# EAGLE board MotionDetectorCamera (EAGLE 9.6.2), part 1 of 2
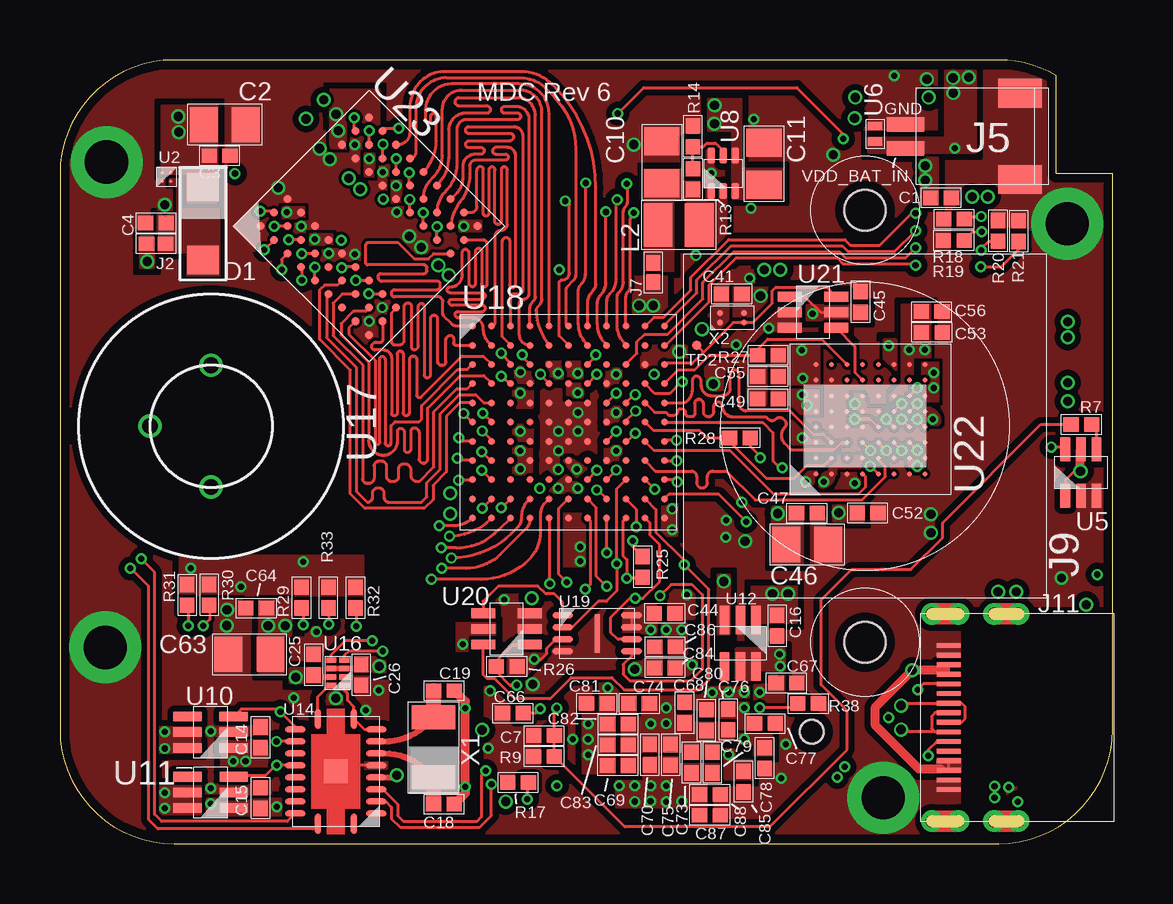
[diagram p9: board, top side]
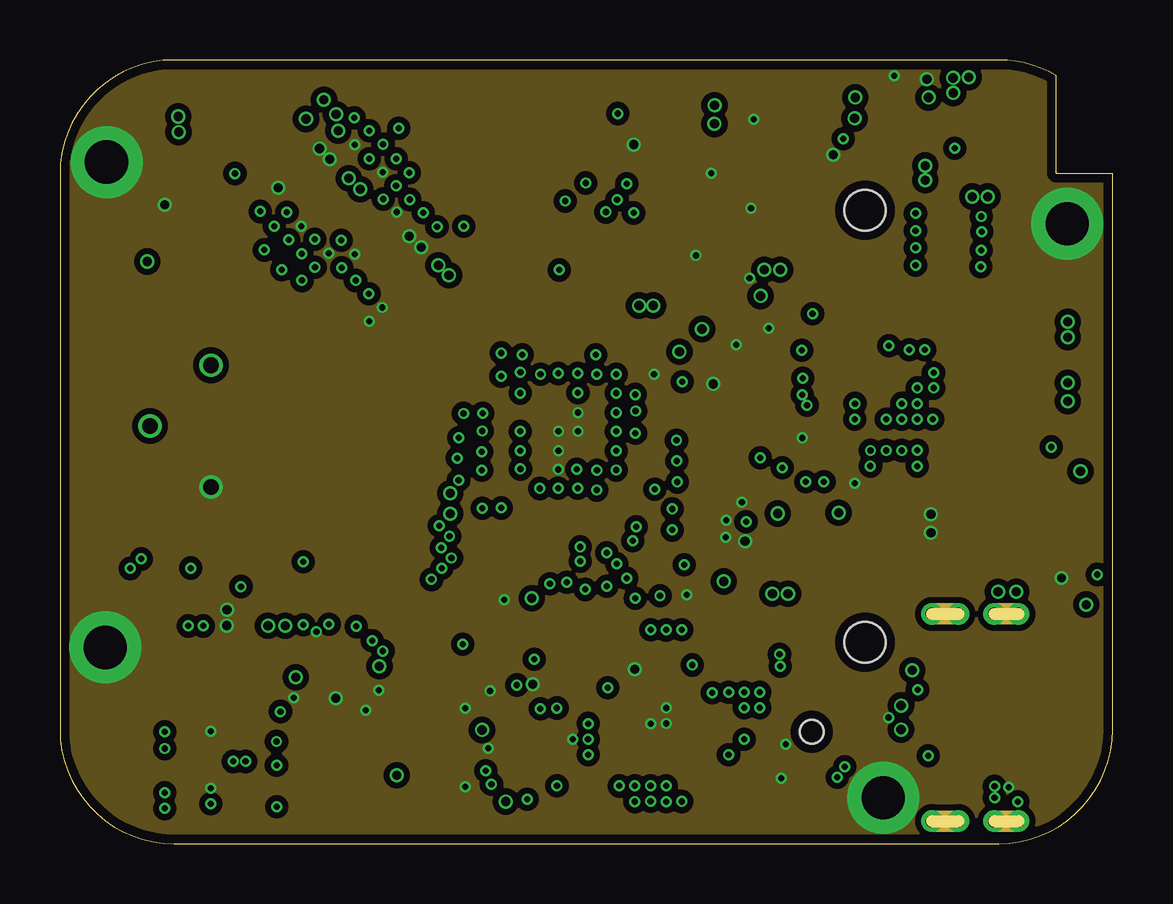
[diagram p10: board, inner layer Ground]
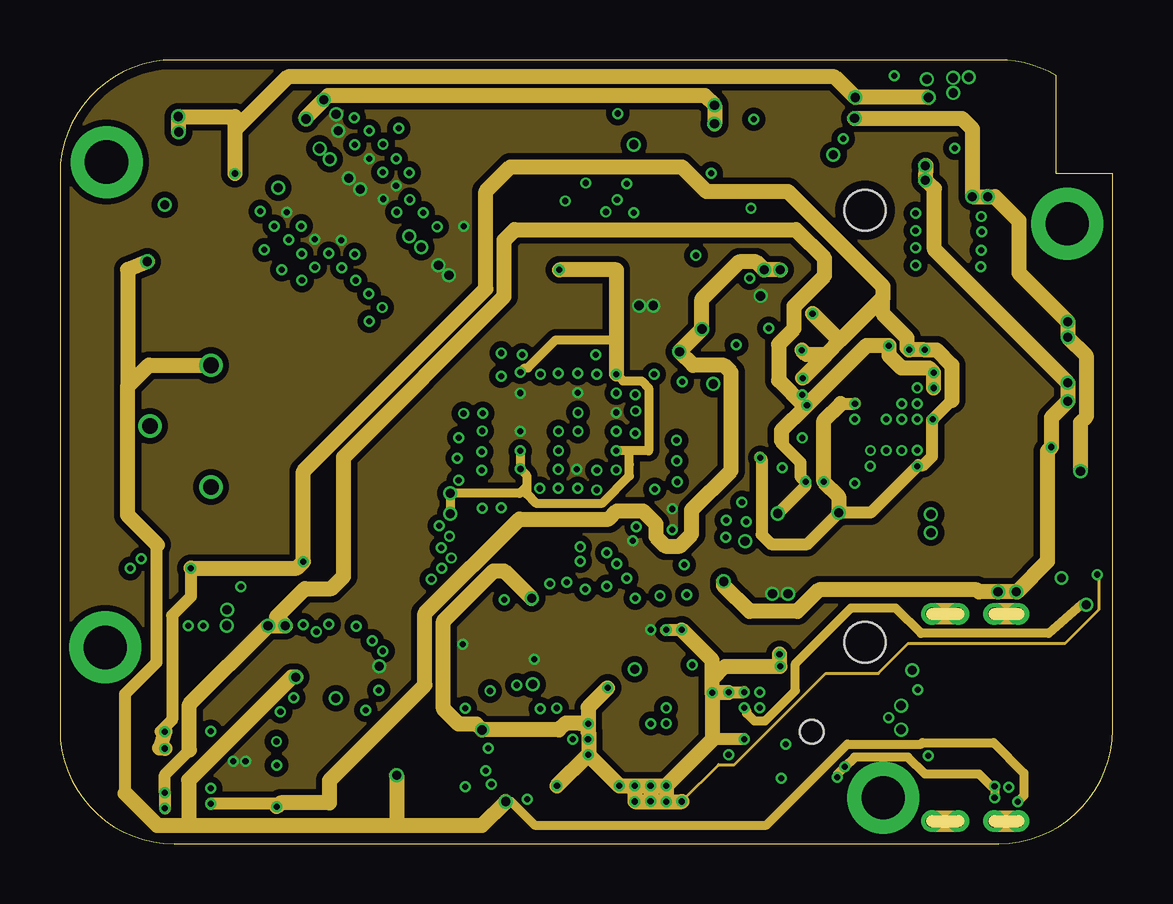
[diagram p11: board, inner layer Power]
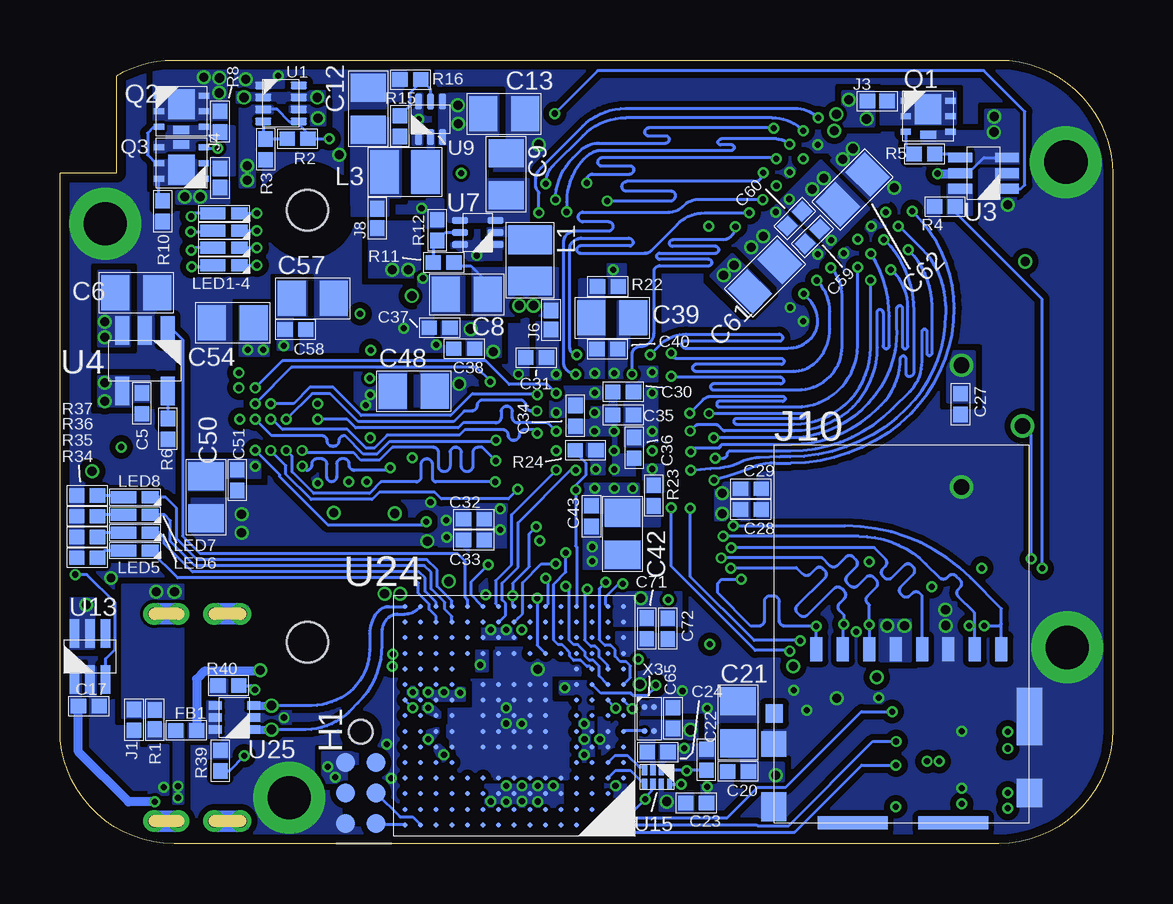
[diagram p12: board, bottom side, seen from below]

Size 43.85 x 32.65 mm. Coordinates in mm from the lower left corner, seen from the top.
Outline: 0,27.9 0,4.75 arc90 4.75,0 39.1,0 arc90 43.85,4.75 43.85,27.94 41.5,27.94 41.5,32 arc30 39.1,32.65 4.75,32.65 arc90 0,27.9
Copper layers (1*2*15*16): Top 0.035559375mm / dielectric 0.17018125mm / Ground 0.01778125mm / dielectric 47mil / Power 0.01778125mm / dielectric 0.17018125mm / Bottom 0.035559375mm
Design rules "oshpark-4layer *": minimum track width 5mil, minimum drill 10mil, track to track 5mil, track to pad 5mil, pad to pad 5mil, via to via 5mil, smd to smd 5mil, copper to edge 15mil, drill to drill 6mil, minimum pad ring 4mil, minimum via ring 4mil, stop-mask expansion 2.5mil, vias tented up to drill 25mil, thermal gap 10mil

## Footprints (pad centres in the part's own frame; a part is rotated, then mirrored left to right if it is on the bottom)
0402 = smd 0.635 x 0.6: 1 -0.432,0; 2 0.432,0
0805 = smd 1.165 x 1.465: 1 -0.875,0; 2 0.875,0
ROHM-SOD-123FL = smd 1.195 x 1.312: 1 -1.525,0; 2 1.525,0
TAGCONNECT-TC2030-NL-EDGE = smd 0.787 x 0.787: 1 -1.27,-0.635; 2 -1.27,0.635; 3 0,-0.635; 4 0,0.635; 5 1.27,-0.635; 6 1.27,0.635 | hole 0.991: -2.54,0
JUMPER-SOLDER = smd 0.65 x 0.6: 1 -0.4,0; 2 0.4,0
JST-SM02B-SRSS-TB = smd 1.2 x 1.8: GND1 -1.8,0; GND2 1.8,0 | smd 0.6 x 1.55: L -0.5,4.775; R 0.5,4.775
M12LENSES-PT-LH008P = hole 1.7: -9,0; 9,0
MOLEX-1051620001 = smd 0.5 x 1: CLK -0.85,0.632; CMD 1.35,0.632; DAT0 -3.05,0.632; DAT1 -4.15,0.632; DAT2 3.55,0.632; DAT3 2.45,0.632; VDD 0.25,0.632; VSS -1.95,0.632 | smd 0.72 x 0.78: DET 5.31,3.312 | smd 1.05 x 1.08: GND1 5.325,4.582 | smd 1.05 x 1.2: GND2 5.325,7.192; GND3 -5.325,6.622 | smd 1.05 x 2.39: GND4 -5.325,3.438 | smd 2.91 x 0.55: NC1 -2.145,7.867; NC2 2.045,7.867
KOREANHRO-TYPE-C-31-M-08A = smd 0.2 x 1: A1 -3,1.125; A4 -2.2,1.125; A5 -1,1.125; A6 -0.2,1.125; A7 0.2,1.125; A8 1,1.125; A9 2.2,1.125; A12 3,1.125; B1 2.6,1.125; B4 1.8,1.125; B5 1.4,1.125; B6 0.6,1.125; B7 -0.6,1.125; B8 -1.4,1.125; B9 -1.8,1.125; B12 -2.6,1.125 | drill 0.5 pad 0.9: GND1 -4.32,1.825; GND2 -4.32,0.725; GND3 4.32,1.825; GND4 4.32,0.725; GND5 4.32,-0.775; GND6 4.32,-1.775; GND7 -4.32,-0.775; GND8 -4.32,-1.775
0806 = smd 1.196 x 1.815: 1 -0.86,0; 2 0.86,0
LED-0603 = smd 0.7 x 0.5: A -0.641,0 | smd 1.05 x 0.5: C 0.475,0
NEXPERIA-SOT1220 = smd 0.43 x 0.25: 1 -0.935,0.65; 2 -0.935,0; 3 -0.935,-0.65; 4 0.935,-0.65; 5 0.935,0; 6 0.935,0.65 | smd 1.1 x 1.25: 7 0,0.285 | smd 0.66 x 0.35: 8 0,-0.775
TEST-POINT = smd 0.4 x 0.4: X 0,0
TI-TPS2116DRLR = smd 0.67 x 0.3: 1 -0.74,0.75; 2 -0.74,0.25; 3 -0.74,-0.25; 4 -0.74,-0.75; 5 0.74,-0.75; 6 0.74,-0.25; 7 0.74,0.25; 8 0.74,0.75
DIODESINC-AP7350 = smd 0.15 x 0.15: 1 -0.175,0.175; 2 -0.175,-0.175; 3 0.175,-0.175; 4 0.175,0.175
NEXPERIA-SOT363 = smd 0.988 x 0.41: 1 -0.97,0.65; 2 -0.97,0; 3 -0.97,-0.65; 4 0.97,-0.65; 5 0.97,0; 6 0.97,0.65
MICROCHIP-MIC550X-SOT23-5 = smd 1.186 x 0.584: 1 -1.264,0.95; 2 -1.264,0; 3 -1.264,-0.95; 4 1.264,-0.95; 5 1.264,0.95
EATON-STN101 = smd 0.35 x 0.6: 1 -0.325,0; 2 0.325,0
TI-TPS62A01DRLR = smd 0.67 x 0.3: 1 -0.74,0.5; 2 -0.74,0; 3 -0.74,-0.5; 4 0.74,-0.5; 5 0.74,0; 6 0.74,0.5
TI-TPS22919DCK = smd 1.186 x 0.397: 1 -0.962,0.65; 2 -0.962,0; 3 -0.962,-0.65; 4 0.962,-0.65; 5 0.962,0; 6 0.962,0.65
TI-MSP430FR2422IRHL = smd 0.26 x 0.86: 1 -0.75,2.185; 10 -0.75,-2.185; 11 0.75,-2.185; 20 0.75,2.185 | smd 0.86 x 0.26: 2 -1.685,1.75; 3 -1.685,1.25; 4 -1.685,0.75; 5 -1.685,0.25; 6 -1.685,-0.25; 7 -1.685,-0.75; 8 -1.685,-1.25; 9 -1.685,-1.75; 12 1.685,-1.75; 13 1.685,-1.25; 14 1.685,-0.75; 15 1.685,-0.25; 16 1.685,0.25; 17 1.685,0.75; 18 1.685,1.25; 19 1.685,1.75 | smd 1 x 1: 21 0,0
NXP-NTB0102GF = smd 0.413 x 0.22: 1 -0.275,0.525; 2 -0.275,0.175; 3 -0.275,-0.175; 4 -0.275,-0.525; 5 0.275,-0.525; 6 0.275,-0.175; 7 0.275,0.175; 8 0.275,0.525
PANASONIC-EKMB110711X = drill 0.65: 1 2.54,0; 2 0,2.54; 3 -2.54,0
LATTICE-ICE40HX4K-BG121 = smd 0.3 x 0.3: A1 -4,4; A2 -3.2,4; A3 -2.4,4; A4 -1.6,4; A5 -0.8,4; A6 0,4; A7 0.8,4; A8 1.6,4; A9 2.4,4; A10 3.2,4; A11 4,4; B1 -4,3.2; B2 -3.2,3.2; B3 -2.4,3.2; B4 -1.6,3.2; B5 -0.8,3.2; B6 0,3.2; B7 0.8,3.2; B8 1.6,3.2; B9 2.4,3.2; B10 3.2,3.2; B11 4,3.2; C1 -4,2.4; C2 -3.2,2.4; C3 -2.4,2.4; C4 -1.6,2.4; C5 -0.8,2.4; C6 0,2.4; C7 0.8,2.4; C8 1.6,2.4; C9 2.4,2.4; C10 3.2,2.4; C11 4,2.4; D1 -4,1.6; D2 -3.2,1.6; D3 -2.4,1.6; D4 -1.6,1.6; D5 -0.8,1.6; D6 0,1.6; D7 0.8,1.6; D8 1.6,1.6; D9 2.4,1.6; D10 3.2,1.6; D11 4,1.6; E1 -4,0.8; E2 -3.2,0.8; E3 -2.4,0.8; E4 -1.6,0.8; E5 -0.8,0.8; E6 0,0.8; E7 0.8,0.8; E8 1.6,0.8; E9 2.4,0.8; E10 3.2,0.8; E11 4,0.8; F1 -4,0; F2 -3.2,0; F3 -2.4,0; F4 -1.6,0; F5 -0.8,0; F6 0,0; F7 0.8,0; F8 1.6,0; F9 2.4,0; F10 3.2,0; F11 4,0; G1 -4,-0.8; G2 -3.2,-0.8; G3 -2.4,-0.8; G4 -1.6,-0.8; G5 -0.8,-0.8; G6 0,-0.8; G7 0.8,-0.8; G8 1.6,-0.8; G9 2.4,-0.8; G10 3.2,-0.8; G11 4,-0.8; H1 -4,-1.6; H2 -3.2,-1.6; H3 -2.4,-1.6; H4 -1.6,-1.6; H5 -0.8,-1.6; H6 0,-1.6; H7 0.8,-1.6; H8 1.6,-1.6; H9 2.4,-1.6; H10 3.2,-1.6; H11 4,-1.6; J1 -4,-2.4; J2 -3.2,-2.4; J3 -2.4,-2.4; J4 -1.6,-2.4; J5 -0.8,-2.4; J6 0,-2.4; J7 0.8,-2.4; J8 1.6,-2.4; J9 2.4,-2.4; J10 3.2,-2.4; J11 4,-2.4; K1 -4,-3.2; K2 -3.2,-3.2; K3 -2.4,-3.2; K4 -1.6,-3.2; K5 -0.8,-3.2; K6 0,-3.2; K7 0.8,-3.2; K8 1.6,-3.2; K9 2.4,-3.2; K10 3.2,-3.2; K11 4,-3.2; L1 -4,-4; L2 -3.2,-4; L3 -2.4,-4; L4 -1.6,-4; L5 -0.8,-4; L6 0,-4; L7 0.8,-4; L8 1.6,-4; L9 2.4,-4; L10 3.2,-4; L11 4,-4
WINBOND-W25Q40EWUXIE = smd 0.86 x 0.27: 1 -1.435,0.75; 2 -1.435,0.25; 3 -1.435,-0.25; 4 -1.435,-0.75; 5 1.435,-0.75; 6 1.435,-0.25; 7 1.435,0.25; 8 1.435,0.75 | smd 0.2 x 1.6: 9 0,0
ON-AR0330CS1C12SPKA0 = smd 0.2 x 0.2: A1 -1.985,2.045; A2 -1.335,2.045; A3 -0.685,2.045; A4 -0.035,2.045; A5 0.615,2.045; A6 1.265,2.045; A7 1.915,2.045; A8 2.565,2.045; B1 -1.985,1.395; B2 -1.335,1.395; B3 -0.685,1.395; B4 -0.035,1.395; B5 0.615,1.395; B6 1.265,1.395; B7 1.915,1.395; B8 2.565,1.395; C1 -1.985,0.745; C2 -1.335,0.745; C3 -0.685,0.745; C4 -0.035,0.745; C5 0.615,0.745; C6 1.265,0.745; C7 1.915,0.745; C8 2.565,0.745; D1 -1.985,0.095; D2 -1.335,0.095; D3 -0.685,0.095; D4 -0.035,0.095; D5 0.615,0.095; D6 1.265,0.095; D7 1.915,0.095; D8 2.565,0.095; E1 -1.985,-0.555; E2 -1.335,-0.555; E3 -0.685,-0.555; E4 -0.035,-0.555; E5 0.615,-0.555; E6 1.265,-0.555; E7 1.915,-0.555; E8 2.565,-0.555; F1 -1.985,-1.205; F2 -1.335,-1.205; F3 -0.685,-1.205; F4 -0.035,-1.205; F5 0.615,-1.205; F6 1.265,-1.205; F7 1.915,-1.205; F8 2.565,-1.205; G1 -1.985,-1.855; G2 -1.335,-1.855; G3 -0.685,-1.855; G4 -0.035,-1.855; G5 0.615,-1.855; G6 1.265,-1.855; G7 1.915,-1.855; G8 2.565,-1.855; H1 -1.985,-2.505; H2 -1.335,-2.505; H3 -0.685,-2.505; H4 -0.035,-2.505; H5 0.615,-2.505; H6 1.265,-2.505; H7 1.915,-2.505; H8 2.565,-2.505
ALLIANCE-AS4C8M16MSA-6BIN = smd 0.33 x 0.33: A1 -3.2,3.2; A2 -2.4,3.2; A3 -1.6,3.2; A7 1.6,3.2; A8 2.4,3.2; A9 3.2,3.2; B1 -3.2,2.4; B2 -2.4,2.4; B3 -1.6,2.4; B7 1.6,2.4; B8 2.4,2.4; B9 3.2,2.4; C1 -3.2,1.6; C2 -2.4,1.6; C3 -1.6,1.6; C7 1.6,1.6; C8 2.4,1.6; C9 3.2,1.6; D1 -3.2,0.8; D2 -2.4,0.8; D3 -1.6,0.8; D7 1.6,0.8; D8 2.4,0.8; D9 3.2,0.8; E1 -3.2,0; E2 -2.4,0; E3 -1.6,0; E7 1.6,0; E8 2.4,0; E9 3.2,0; F1 -3.2,-0.8; F2 -2.4,-0.8; F3 -1.6,-0.8; F7 1.6,-0.8; F8 2.4,-0.8; F9 3.2,-0.8; G1 -3.2,-1.6; G2 -2.4,-1.6; G3 -1.6,-1.6; G7 1.6,-1.6; G8 2.4,-1.6; G9 3.2,-1.6; H1 -3.2,-2.4; H2 -2.4,-2.4; H3 -1.6,-2.4; H7 1.6,-2.4; H8 2.4,-2.4; H9 3.2,-2.4; J1 -3.2,-3.2; J2 -2.4,-3.2; J3 -1.6,-3.2; J7 1.6,-3.2; J8 2.4,-3.2; J9 3.2,-3.2
STM-STM32F730I8 = smd 0.2 x 0.2: A1 -4.55,4.55; A2 -3.9,4.55; A3 -3.25,4.55; A4 -2.6,4.55; A5 -1.95,4.55; A6 -1.3,4.55; A7 -0.65,4.55; A8 0,4.55; A9 0.65,4.55; A10 1.3,4.55; A11 1.95,4.55; A12 2.6,4.55; A13 3.25,4.55; A14 3.9,4.55; A15 4.55,4.55; B1 -4.55,3.9; B2 -3.9,3.9; B3 -3.25,3.9; B4 -2.6,3.9; B5 -1.95,3.9; B6 -1.3,3.9; B7 -0.65,3.9; B8 0,3.9; B9 0.65,3.9; B10 1.3,3.9; B11 1.95,3.9; B12 2.6,3.9; B13 3.25,3.9; B14 3.9,3.9; B15 4.55,3.9; C1 -4.55,3.25; C2 -3.9,3.25; C3 -3.25,3.25; C4 -2.6,3.25; C5 -1.95,3.25; C6 -1.3,3.25; C7 -0.65,3.25; C8 0,3.25; C9 0.65,3.25; C10 1.3,3.25; C11 1.95,3.25; C12 2.6,3.25; C13 3.25,3.25; C14 3.9,3.25; C15 4.55,3.25; D1 -4.55,2.6; D2 -3.9,2.6; D3 -3.25,2.6; D4 -2.6,2.6; D5 -1.95,2.6; D6 -1.3,2.6; D7 -0.65,2.6; D8 0,2.6; D9 0.65,2.6; D10 1.3,2.6; D11 1.95,2.6; D12 2.6,2.6; D13 3.25,2.6; D14 3.9,2.6; D15 4.55,2.6; E1 -4.55,1.95; E2 -3.9,1.95; E3 -3.25,1.95; E4 -2.6,1.95; E12 2.6,1.95; E13 3.25,1.95; E14 3.9,1.95; E15 4.55,1.95; F1 -4.55,1.3; F2 -3.9,1.3; F3 -3.25,1.3; F4 -2.6,1.3; F6 -1.3,1.3; F7 -0.65,1.3; F8 0,1.3; F9 0.65,1.3; F10 1.3,1.3; F12 2.6,1.3; F13 3.25,1.3; F14 3.9,1.3; F15 4.55,1.3; G1 -4.55,0.65; G2 -3.9,0.65; G3 -3.25,0.65; G4 -2.6,0.65; G6 -1.3,0.65; G7 -0.65,0.65; G8 0,0.65; G9 0.65,0.65; G10 1.3,0.65; G12 2.6,0.65; G13 3.25,0.65; G14 3.9,0.65; G15 4.55,0.65; H1 -4.55,0; H2 -3.9,0; H3 -3.25,0; H4 -2.6,0; H6 -1.3,0; H7 -0.65,0; H8 0,0; H9 0.65,0; H10 1.3,0; H12 2.6,0; H13 3.25,0; H14 3.9,0; H15 4.55,0; J1 -4.55,-0.65; J2 -3.9,-0.65; J3 -3.25,-0.65; J4 -2.6,-0.65; J6 -1.3,-0.65; J7 -0.65,-0.65; J8 0,-0.65; J9 0.65,-0.65; J10 1.3,-0.65; J12 2.6,-0.65; J13 3.25,-0.65; J14 3.9,-0.65; J15 4.55,-0.65; K1 -4.55,-1.3; K2 -3.9,-1.3; K3 -3.25,-1.3; K4 -2.6,-1.3; K6 -1.3,-1.3; K7 -0.65,-1.3; K8 0,-1.3; K9 0.65,-1.3; K10 1.3,-1.3; K12 2.6,-1.3; K13 3.25,-1.3; K14 3.9,-1.3; K15 4.55,-1.3; L1 -4.55,-1.95; L2 -3.9,-1.95; L3 -3.25,-1.95; L4 -2.6,-1.95; L12 2.6,-1.95; L13 3.25,-1.95; L14 3.9,-1.95; L15 4.55,-1.95; M1 -4.55,-2.6; M2 -3.9,-2.6; M3 -3.25,-2.6; M4 -2.6,-2.6; M5 -1.95,-2.6; M6 -1.3,-2.6; M7 -0.65,-2.6; M8 0,-2.6; M9 0.65,-2.6; M10 1.3,-2.6; M11 1.95,-2.6; M12 2.6,-2.6; M13 3.25,-2.6; M14 3.9,-2.6; M15 4.55,-2.6; N1 -4.55,-3.25; N2 -3.9,-3.25; N3 -3.25,-3.25; N4 -2.6,-3.25; N5 -1.95,-3.25; N6 -1.3,-3.25; N7 -0.65,-3.25; N8 0,-3.25; N9 0.65,-3.25; N10 1.3,-3.25; N11 1.95,-3.25; N12 2.6,-3.25; N13 3.25,-3.25; N14 3.9,-3.25; N15 4.55,-3.25; P1 -4.55,-3.9; P2 -3.9,-3.9; P3 -3.25,-3.9; P4 -2.6,-3.9; P5 -1.95,-3.9; P6 -1.3,-3.9; P7 -0.65,-3.9; P8 0,-3.9; P9 0.65,-3.9; P10 1.3,-3.9; P11 1.95,-3.9; P12 2.6,-3.9; P13 3.25,-3.9; P14 3.9,-3.9; P15 4.55,-3.9; R1 -4.55,-4.55; R2 -3.9,-4.55; R3 -3.25,-4.55; R4 -2.6,-4.55; R5 -1.95,-4.55; R6 -1.3,-4.55; R7 -0.65,-4.55; R8 0,-4.55; R9 0.65,-4.55; R10 1.3,-4.55; R11 1.95,-4.55; R12 2.6,-4.55; R13 3.25,-4.55; R14 3.9,-4.55; R15 4.55,-4.55
DIODESINC-DT1446-04V-7 = smd 0.546 x 0.337: 1 -0.796,0.5; 2 -0.796,0; 3 -0.796,-0.5; 4 0.796,-0.5; 5 0.796,0; 6 0.796,0.5
EPSON-FC-135 = smd 1 x 1.8: 1 -1.25,0; 2 1.25,0
SITIME-SIT8021 = smd 0.25 x 0.25: 1 -0.205,0.5; 2 -0.205,-0.5; 3 0.205,-0.5; 4 0.205,0.5

## Placement (x,y rotation side)
C1  2.2u  [0402]  36.71,26.9 0 top
C2  10u  [0805]  6.86,29.96 0 top
C3  100n  [0402]  6.65,28.66 0 top
C4  100n  [0402]  4,25.86 180 top
C5  2.2u  [0402]  40.45,18.34 270 bottom
C6  10u  [0805]  40.68,22.96 0 bottom
C7  100n  [0402]  20.17,4.5 180 top
C8  22u  [0805]  26.91,22.88 180 bottom
C9  10u  [0805]  25.27,27.89 90 bottom
C10  22u  [0805]  25.08,28.4 90 top
C11  10u  [0805]  29.33,28.33 90 top
C12  22u  [0805]  31.01,30.62 90 bottom
C13  10u  [0805]  25.35,30.41 0 bottom
C14  2.2u  [0402]  8.36,4.43 90 top
C15  2.2u  [0402]  8.36,1.9 90 top
C16  2.2u  [0402]  29.88,9.08 270 top
C17  2.2u  [0402]  42.65,5.73 0 bottom
C18  22p  [0402]  16,1.65 0 top
C19  22p  [0402]  16,6.37 0 top
C20  100n  [0402]  15.6,3.01 180 bottom
C21  10u  [0805]  15.61,5.05 90 bottom
C22  22p  [0402]  16.92,3.49 90 bottom
C23  100n  [0402]  17.35,1.69 0 bottom
C24  100n  [0402]  18.95,3.81 0 bottom
C25  100n  [0402]  10.57,7.45 90 top
C26  100n  [0402]  12.55,7.03 270 top
C27  100n  [0402]  6.33,18.31 270 bottom
C28  100n  [0402]  15.07,13.92 0 bottom
C29  10n  [0402]  15.07,14.78 0 bottom
C30  100n  [0402]  20.39,18.82 180 bottom
C31  10n  [0402]  24.01,20.25 180 bottom
C32  100n  [0402]  26.61,13.52 180 bottom
C33  10n  [0402]  26.61,12.65 180 bottom
C34  10n  [0402]  22.38,17.82 270 bottom
C35  100n  [0402]  20.39,17.86 180 bottom
C36  10n  [0402]  19.93,16.49 270 bottom
C37  100n  [0402]  28.04,21.49 180 bottom
C38  10n  [0402]  27.01,20.62 180 bottom
C39  10u  [0805]  20.85,21.91 0 bottom
C40  100n  [0402]  21.04,20.6 0 bottom
C41  10n  [0402]  27.98,22.9 180 top
C42  10u  [0805]  20.41,12.9 270 bottom
C43  100n  [0402]  21.71,13.64 270 bottom
C44  100n  [0402]  25.19,9.6 0 top
C45  100n  [0402]  33.36,22.58 90 top
C46  10u  [0805]  31.13,12.46 0 top
C47  100n  [0402]  31.12,13.77 0 top
C48  10u  [0805]  29.11,18.85 0 bottom
C49  100n  [0402]  29.5,18.53 180 top
C50  10u  [0805]  37.77,14.44 270 bottom
C51  100n  [0402]  36.47,15.15 270 bottom
C52  100n  [0402]  33.65,13.78 0 top
C53  100n  [0402]  36.32,21.3 0 top
C54  10u  [0805]  36.66,21.71 180 bottom
C55  100n  [0402]  29.5,19.46 180 top
C56  100n  [0402]  36.31,22.17 0 top
C57  10u  [0805]  33.33,22.72 0 bottom
C58  100n  [0402]  34.04,21.42 0 bottom
C59  100n  [0402]  12.5,25.3 225 bottom
C60  100n  [0402]  13.24,26.04 225 bottom
C61  10u  [0805]  14.48,23.63 45 bottom
C62  10u  [0805]  10.83,27.26 45 bottom
C63  10u  [0805]  7.89,7.88 180 top
C64  100n  [0402]  8.18,9.81 180 top
C65  10n  [0402]  18.31,5.22 90 bottom
C66  100n  [0402]  18.87,5.43 180 top
C67  2.2u  [0402]  30.26,6.69 0 top
C68  100n  [0402]  26.02,5.46 270 top
C69  100n  [0402]  23.24,3.26 0 top
C70  100n  [0402]  24.57,3.71 90 top
C71  100n  [0402]  19.41,8.96 270 bottom
C72  2.2u  [0402]  18.53,8.96 270 bottom
C73  100n  [0402]  26.31,3.38 90 top
C74  100n  [0402]  24.13,5.84 0 top
C75  100n  [0402]  25.45,3.7 90 top
C76  100n  [0402]  27.84,5.17 270 top
C77  2.2u  [0402]  29.37,5 0 top
C78  100n  [0402]  29.35,3.56 270 top
C79  100n  [0402]  27.18,3.38 90 top
C80  100n  [0402]  26.93,5.14 270 top
C81  100n  [0402]  22.37,5.84 180 top
C82  100n  [0402]  23.25,4.98 0 top
C83  100n  [0402]  23.25,4.12 0 top
C84  2.2u  [0402]  25.21,7.32 180 top
C85  2.2u  [0402]  28.48,2.59 270 top
C86  2.2u  [0402]  25.21,8.2 180 top
C87  2.2u  [0402]  27.08,1.18 0 top
C88  2.2u  [0402]  27.08,2.05 0 top
D1  ROHM-RB168MM-40  [ROHM-SOD-123FL]  5.96,25.84 90 top
FB1  FERRITE-BEAD0402  [0402]  38.59,4.72 180 bottom
H1  TAGCONNECT-TC2030-NLEDGE  [TAGCONNECT-TC2030-NL-EDGE]  31.33,2.12 270 bottom
J1  JUMPER-SOLDER  [JUMPER-SOLDER]  39.91,5.16 90 bottom
J2  JUMPER-SOLDER  [JUMPER-SOLDER]  4,24.99 180 top
J3  JUMPER-SOLDER  [JUMPER-SOLDER]  9.8,30.94 180 bottom
J4  JUMPER-SOLDER  [JUMPER-SOLDER]  37.19,27.73 90 bottom
J5  JST-SM02B-SRSS-TB  [JST-SM02B-SRSS-TB]  40,29.47 90 top
J6  JUMPER-SOLDER  [JUMPER-SOLDER]  23.4,21.82 270 bottom
J7  JUMPER-SOLDER  [JUMPER-SOLDER]  24.72,23.8 270 top
J8  JUMPER-SOLDER  [JUMPER-SOLDER]  30.64,26.05 270 bottom
J9  S-MOUNT-LENS-HOLDERM12LENSES-PT-LH008P  [M12LENSES-PT-LH008P]  33.54,17.39 90 top
J10  MICROSD-SOCKET  [MOLEX-1051620001]  8.78,8.73 180 bottom
J11  USB-C-RECEPTACLE-KOREANHRO  [KOREANHRO-TYPE-C-31-M-08A]  38.15,5.25 90 top
L1  1u  [0806]  24.26,24.3 270 bottom
L2  1u  [0806]  25.77,25.77 180 top
L3  1u  [0806]  29.48,27.99 180 bottom
LED1  LED  [LED-0603]  37.01,26.26 180 bottom
LED2  LED  [LED-0603]  37.01,25.54 180 bottom
LED3  LED  [LED-0603]  37.01,24.82 180 bottom
LED4  LED  [LED-0603]  37.01,24.1 180 bottom
LED5  LED  [LED-0603]  40.73,12.21 180 bottom
LED6  LED  [LED-0603]  40.73,12.95 180 bottom
LED7  LED  [LED-0603]  40.73,13.69 180 bottom
LED8  LED  [LED-0603]  40.73,14.43 180 bottom
Q1  PMOS-NEXPERIA-SOT1220  [NEXPERIA-SOT1220]  7.68,30.31 0 bottom
Q2  PMOS-NEXPERIA-SOT1220  [NEXPERIA-SOT1220]  38.8,30.51 0 bottom
Q3  PMOS-NEXPERIA-SOT1220  [NEXPERIA-SOT1220]  38.8,28.35 180 bottom
R1  100k  [0402]  40.77,5.16 270 bottom
R2  300k  [0402]  33.96,29.37 180 bottom
R3  100k  [0402]  35.29,28.93 270 bottom
R4  100k  [0402]  6.98,26.54 180 bottom
R5  10k  [0402]  7.84,28.73 0 bottom
R6  2.7k  [0402]  39.36,17.28 90 bottom
R7  300k  [0402]  42.56,17.46 180 top
R8  100k  [0402]  37.19,30.09 270 bottom
R9  100k  [0402]  20.16,3.63 180 top
R10  100k  [0402]  39.58,26.35 270 bottom
R11  100k  [0402]  27.87,24.21 180 bottom
R12  100k  [0402]  28.14,25.56 90 bottom
R13  200k  [0402]  26.37,27.69 90 top
R14  100k  [0402]  26.37,29.47 90 top
R15  365k  [0402]  29.69,29.9 90 bottom
R16  100k  [0402]  29.25,31.83 180 bottom
R17  10k  [0402]  19.09,2.55 0 top
R18  1.8k  [0402]  37.25,26.02 180 top
R19  1.8k  [0402]  37.24,25.13 180 top
R20  1.8k  [0402]  39.08,25.53 90 top
R21  1.8k  [0402]  39.94,25.52 90 top
R22  100  [0402]  21.03,23.21 0 bottom
R23  100  [0402]  19.12,14.5 90 bottom
R24  10k  [0402]  21.96,16.39 180 bottom
R25  10k  [0402]  24.28,11.53 270 top
R26  10k  [0402]  18.61,7.38 0 top
R27  10k  [0402]  29.5,20.35 0 top
R28  10k  [0402]  28.33,16.9 180 top
R29  47k  [0402]  10.06,10.24 90 top
R30  47k  [0402]  6.21,10.37 90 top
R31  47k  [0402]  5.3,10.36 90 top
R32  47k  [0402]  12.32,10.25 90 top
R33  47k  [0402]  11.18,10.25 90 top
R34  1.8k  [0402]  42.72,11.91 180 bottom
R35  1.8k  [0402]  42.72,12.78 180 bottom
R36  1.8k  [0402]  42.72,13.64 180 bottom
R37  1.8k  [0402]  42.72,14.5 180 bottom
R38  3k  [0402]  31.17,5.83 180 top
R39  5.1k  [0402]  37.17,3.45 90 bottom
R40  5.1k  [0402]  36.84,6.58 180 bottom
TP2  TEST-POINT  [TEST-POINT]  26.52,20.77 0 top
U1  TI-TPS2116  [TI-TPS2116DRLR]  34.65,30.84 0 bottom
U2  DIODESINC-AP7350  [DIODESINC-AP7350]  4.44,27.78 0 top
U3  NEXPERIA-74LVC1G98-NOR  [NEXPERIA-SOT363]  5.37,27.94 180 bottom
U4  MICROCHIP-MCP7383X  [MICROCHIP-MIC550X-SOT23-5]  40.32,20.12 270 bottom
U5  NEXPERIA-74LVC1G98-BUFFER  [NEXPERIA-SOT363]  42.54,15.46 90 top
U6  EATON-STN101  [EATON-STN101]  33.96,29.58 90 top
U7  TI-TPS62A01  [TI-TPS62A01DRLR]  26.45,25.46 180 bottom
U8  TI-TPS62A01  [TI-TPS62A01DRLR]  27.63,27.92 90 top
U9  TI-TPS62A01  [TI-TPS62A01DRLR]  28.42,30.18 90 bottom
U10  TI-TPS22919DCK  [TI-TPS22919DCK]  6.27,4.64 180 top
U11  TI-TPS22919DCK  [TI-TPS22919DCK]  6.28,2.14 180 top
U12  TI-TPS22919DCK  [TI-TPS22919DCK]  28.35,8.35 270 top
U13  TI-TPS22919DCK  [TI-TPS22919DCK]  42.6,7.8 90 bottom
U14  TI-MSP430FR2422IRHL  [TI-MSP430FR2422IRHL]  11.49,3.01 180 top
U15  NXP-NTB0102  [NXP-NTB0102GF]  18.98,2.77 270 bottom
U16  NXP-NTB0102  [NXP-NTB0102GF]  11.57,7.12 180 top
U17  PANASONIC-EKMB110711X  [PANASONIC-EKMB110711X]  6.29,17.39 90 top
U18  LATTICE-ICE40HX4K-BG121  [LATTICE-ICE40HX4K-BG121]  21.18,17.56 0 top
U19  WINBOND-W25Q40EW  [WINBOND-W25Q40EWUXIE]  22.38,8.76 0 top
U20  NEXPERIA-74LVC1G98-OR-INV-INPUT  [NEXPERIA-SOT363]  18.61,8.94 180 top
U21  NEXPERIA-74LVC1G98-BUFFER  [NEXPERIA-SOT363]  31.38,22.14 0 top
U22  ON-AR0330CS1C12SPKA0  [ON-AR0330CS1C12SPKA0]  33.54,17.39 90 top
U23  ALLIANCE-AS4C8M16MSA-6BIN  [ALLIANCE-AS4C8M16MSA-6BIN]  12.88,25.72 45 top
U24  STM-STM32F730  [STM-STM32F730I8]  24.93,5.33 180 bottom
U25  DIODESINC-DT1446-04V-7  [DIODESINC-DT1446-04V-7]  36.58,5.25 180 bottom
X1  EPSON-FC-135  [EPSON-FC-135]  15.57,4.01 90 top
X2  SITIME-SIT8021  [SITIME-SIT8021]  28.01,21.91 90 top
X3  SITIME-SIT8021  [SITIME-SIT8021]  19.3,5.2 0 bottom

## Tracks (layer width: path | path; a pad name or v marks a point on that pad's centre or on a via)
BAT_CHRG_LVL  (via drill 0.25)
  Top 0.127: v20.7,5.65 20.6,5.54 C7.1 R9.1 23.54,0.69 29.57,0.69 32.79,3.92 32.79,5.53 31.72,6.61 31.72,10.16 32.99,11.43 35.45,11.43 36.77,12.75 36.77,13.37 40.87,17.46 R7.2
  Bottom 0.127: U24.J2 v20.7,5.65
BAT_CHRG_STAT
  Bottom 0.127: U4.1 39.14,21.39 38.75,21 38.75,12.81 38.03,12.09 27.3,12.09 26.99,11.78 26.99,10.28 26.88,10.17 U24.R11
GND  (via drill 0.25, 0.35, 0.38, 1.8 pad 3)
  Top 0.127: U14.6 11.49,3.26 U14.21
  Top 0.381: C18.2 16.89,2.1 v16.89,2.37 v16.89,5.65 16.89,5.91 C19.2
  other vias: 21.58,17.96 21.58,17.17 20.77,17.17 20.77,16.36 25.26,5 25.25,5.65 24.61,5 21.36,4.35 10.81,28.96 11.24,28.51 14.56,25.3 15.06,24.84 9.09,27.33 10.06,25.73 11.2,24.59 12.89,21.76 12.29,29.11 13.45,27.97 12.28,24.56 14.04,26.32 6.96,9.74 6.95,9.09 4.36,26.62 19.69,6.63 23.95,7.26 27.76,13.47 27.75,12.76 17.84,3.97 20.77,15.59 13.43,22.34 11.5,6.06 28.54,12.6 26.12,10.37 27.13,27.93 28.9,30.19 28.42,14.22 6.28,4.68 6.28,2.3 27.22,19.15 18.51,10.16 17.92,6.36 33.11,15.01 36.12,31.84 34.76,32 28.18,20.78 29.53,21.47 30.24,4.14 30.05,2.72 13.29,6.39 12.74,5.55 9.74,6.07 24.75,19.56 28.73,23.56 34.52,5.25 26.5,24.51 23.91,29.13 32.23,28.7 28.79,26.47 36.29,13.72 36.29,12.95 30.93,16.9 1.89,8.17 1.94,28.4 41.73,11.07 41.97,25.83 34.31,1.91 39.52,2.35 10.69,8.83
  pour Ground (isolate 0.254, rank 6, no thermals): -2.64,35.56 -2.64,-3.1 47.38,-3.1 47.38,35.56
  pour Top (rank 2, no thermals): 20.14,18.91 20.14,15.87 20.6,15.41 20.75,15.41 21.85,16.51 22.07,16.51 22.19,16.64 22.19,18.35 20.87,18.35 20.87,18.91
  pour Top (isolate 0.254, rank 6, no thermals): -1.91,34.65 -1.91,-2.1 46.51,-2.1 46.51,34.65
  pour Bottom (isolate 0.254, rank 6, no thermals): -3.58,36.53 -3.58,-3.91 48.32,-3.91 48.32,36.53
  pour Bottom (no thermals): 26.77,13.79 26.77,12.38 28.06,12.38 28.06,13.79
  pour Bottom (no thermals): 8.73,27.34 9.67,26.39 11.74,28.46 10.8,29.4
  pour Bottom (no thermals): 11.97,24.59 13.65,22.91 15.68,24.94 14,26.62
  pour Top (no thermals): 7.69,25.4 8.09,25 8.67,25.58 8.27,25.98
  pour Top (rank 2, no thermals): 7.05,25.71 12.9,19.86 18.75,25.7 12.89,31.56
  pour Top (rank 3, no thermals): 30.44,14.53 37.11,14.53 37.11,20.85 30.44,20.85
  pour Top (no thermals): 11.14,3.15 13.64,3.15 13.64,3.37 11.83,3.37 11.83,5.57 11.14,5.57
  pour Top: 33.82,19.21 arc90 33.57,18.95 arc90 33.97,18.55 34.17,18.55 34.17,18.86 arc90
  pour Top (rank 3, no thermals): 4.1,26.37 4.72,26.37 4.72,27.73 4.1,27.73
  pour Top (no thermals): 6.43,10.15 6.43,7.07 7.56,7.07 7.56,10.15
  pour Bottom (rank 2, no thermals): 16.58,4.2 16.58,3.48 18.63,3.48 18.63,2.9 18.94,2.9 18.94,4.2
  pour Bottom (no thermals): 18.05,5.97 18.05,5.37 19.65,5.37 19.65,5.97
  pour Top (rank 2, no thermals): 20.41,8.18 20.41,8.03 19.4,7.01 19.4,6.25 20.16,6.25 20.16,6.76 20.92,7.52 21.39,7.52 21.39,8.18
  pour Bottom (rank 2, no thermals): 24.73,8.03 24.73,6.51 25.75,6.51 25.75,8.03
  pour Bottom (rank 2, no thermals): 22.7,4.22 22.7,2.68 25.75,2.68 25.75,4.22
  pour Top (no thermals): 24.48,8.41 24.48,7.54 23.72,7.54 23.72,7.01 25.07,7.01 25.07,8.41
  pour Bottom (no thermals): 19.14,8.79 20.67,8.79 20.67,7.78 19.14,7.78
  pour Bottom (no thermals): 22.19,7.52 22.19,7.01 24.23,7.01 24.23,7.52
  pour Top (no thermals): 11.15,4.5 11.15,6.28 11.9,6.28 11.9,4.5
  pour Bottom (rank 2, no thermals): 20.98,5.24 20.98,3.97 21.54,3.97 21.54,5.24
  pour Top (no thermals): 25.37,10.63 25.37,9.4 26.42,9.4 26.42,10.63
  pour Top (rank 2, no thermals): 6.12,4.84 6.12,4.49 8.67,4.49 8.67,5.17 8.11,5.17 8.11,4.84
  pour Top (rank 2, no thermals): 6.12,2.45 7.99,2.45 7.99,2.58 8.75,2.58 8.75,2.03 6.12,2.03
  pour Bottom (no thermals): 26.97,19.66 26.97,18.15 28.8,18.15 28.8,19.66
  pour Top (no thermals): 11.71,6.99 12.85,6.99 12.85,6.35 12.28,6.35 12.28,6.86 11.71,6.86
  pour Top (rank 2, no thermals): 23.4,5.22 23.4,2.96 24.1,2.96 24.1,3.85 26,3.85 26,3.54 27.43,3.54 27.43,4.39 28.12,4.39 28.12,5.02 26.38,5.02 26.38,5.33 25.62,5.33 25.62,6.1 24.25,6.1 24.25,5.22
  pour Bottom (rank 2, no thermals): 28.77,31.24 28.77,29.13 29.14,29.13 29.14,31.24
  pour Top (rank 2, no thermals): 28.92,23.88 27.15,23.88 27.15,21.51 27.91,21.51 27.91,23.33 28.92,23.33
  pour Bottom (rank 2, no thermals): 36.89,6.86 36.89,6.1 36.04,6.1 36.04,4.32 36.82,4.32 36.82,3.56 37.56,3.56 37.56,4.57 37.21,4.57 37.21,6.1 37.56,6.1 37.56,6.86
  pour Bottom (no thermals): 34.26,5.72 34.26,4.83 36.04,4.83 36.04,5.72
  pour Bottom (no thermals): 27.15,23.62 28.92,23.62 28.92,22.1 27.15,22.1
  pour Bottom (no thermals): 25.42,25.08 27.4,25.08 27.4,24.89 26.84,24.34 26.23,24.34 25.73,24.83 25.42,24.83
  pour Top (no thermals): 26.95,28.96 26.95,26.94 27.22,26.94 27.22,28.96
  pour Bottom (no thermals): 27.91,26.84 27.91,25.65 28.55,25.65 28.55,26.84
  pour Bottom (no thermals): 3.93,28.11 5.56,28.11 5.56,26.35 4.03,26.35 4.03,26.92 5.05,26.92 5.05,27.69 3.93,27.69
  pour Bottom (no thermals): 26.13,5.59 27.6,5.59 27.6,3.96 26.13,3.96
  pour Top (no thermals): 29.4,20.1 29.4,18.3 28.7,18.3 28.7,19.6 27.6,19.6 27.6,18.9 26.9,18.9 26.9,20.1
  pour Bottom (no thermals): 42.39,7.37 42.39,6.1 41.88,6.1 41.88,5.33 42.76,5.33 42.76,7.37
  pour Bottom (no thermals): 39.37,4.1 39.37,2.03 40.13,2.03 40.13,4.1
  pour Top (no thermals): 10.23,8.99 10.23,7.62 10.85,7.62 10.85,8.99
  pour Bottom (no thermals): 6.54,10.05 6.54,7.62 7.26,7.62 7.26,10.05
  pour Bottom (no thermals): 34.54,32.26 34.54,31.5 36.38,31.5 36.38,32.26
GNDPLL0  (via drill 0.25)
  other vias: 21.68,12.36 21.68,11.76
  pour Bottom (no thermals): 19.69,12.6 19.69,11.45 22.02,11.45 22.02,13.51 21.43,13.51 21.43,12.6
  pour Top (no thermals): 20.92,13.72 20.92,11.59 21.86,11.59 21.86,13.72
GNDPLL1  (via drill 0.25)
  other vias: 20.76,19.59
  pour Top (rank 4, no thermals): 20.27,20.06 20.27,19.39 20.94,19.39 20.94,20.06
  pour Bottom (no thermals): 19.4,22.61 19.4,21.24 20.16,21.24 20.16,19.4 20.95,19.4 20.95,20.98 20.59,20.98 20.59,22.61
ICE_CDONE  (via drill 0.25)
  Top 0.127: U18.K8 22.41,14.73 v22.37,14.73
  Bottom 0.127: U24.R4 22.32,9.89 22.32,12.35 22.37,12.4 v22.37,14.73 22.37,14.92 21.95,15.34 21.95,15.88 22.39,16.31 R24.2
ICE_CRST_  (via drill 0.25)
  Top 0.127: U18.L9 23.45,13.43 23.45,12 23.62,11.83 v23.62,11.06 | v23.62,11.06 | R25.2 24.24,11.06 v23.62,11.06
  Bottom 0.127: U24.R6 23.54,9.97 23.54,10.99 v23.62,11.06
ICE_IMG_CLK16MHZ
  Top 0.127: U18.C11 25.22,20.01 26.35,20.01 26.78,20.44 | U21.6 | U21.6 31.95,23.18 29.83,23.18 29.68,23.04 29.68,22.52 28.87,21.7 X2.2 28.05,21.71 26.78,20.44 | TP2.X 26.78,20.51 26.78,20.44
ICE_LED0  (via drill 0.25)
  Top 0.127: U18.A10 24.75,21.93 25.16,21.93 26.28,23.06 26.28,23.59 27.86,25.16 32.7,25.16 32.94,24.93 34.15,24.93 35.48,26.26 v35.65,26.26
  Bottom 0.127: LED1.A v35.65,26.26
ICE_LED1  (via drill 0.25)
  Top 0.127: U18.A11 25.18,21.59 26.54,22.95 26.54,23.49 27.96,24.91 32.59,24.91 32.83,24.67 34.78,24.67 v35.65,25.54
  Bottom 0.127: LED2.A v35.65,25.54
ICE_LED2  (via drill 0.25)
  Top 0.127: U18.C9 24.04,20.43 24.04,20.9 24.36,21.22 25.32,21.22 26.79,22.69 26.79,23.38 28.07,24.66 32.49,24.66 32.73,24.42 35.24,24.42 v35.65,24.82
  Bottom 0.127: LED3.A v35.65,24.82
ICE_LED3  (via drill 0.25)
  Top 0.127: U18.B11 25.24,20.76 27.04,22.57 27.04,23.27 28.17,24.4 32.38,24.4 32.62,24.16 35.59,24.16 v35.65,24.1
  Bottom 0.127: LED4.A v35.65,24.1
ICE_MSP_SPI_CLK  (via drill 0.25)
  Top 0.127: U18.K2 v17.59,13.98 v17.59,13.97 | v13.01,8.45 11.89,8.45 11.3,7.86 U16.5
  Bottom 0.127: v17.59,13.97 17.59,11.12 14.94,8.46 13.03,8.46 v13.01,8.45
ICE_MSP_SPI_CLK_X
  Top 0.127: U14.11 10.74,6.13 11.16,6.54 11.3,6.54 U16.8
ICE_MSP_SPI_DATA  (via drill 0.25)
  Top 0.127: U18.K3 18.4,13.99 v18.38,13.99 | U16.4 11.85,7.84 12.03,8.02 v13.46,8.02
  Bottom 0.127: v13.46,8.02 13.49,8.05 14.89,8.05 18.38,11.55 v18.38,13.99
ICE_MSP_SPI_DATA_X
  Top 0.127: U14.9 12.68,4.76 U14.10 12.24,5.7 11.98,5.96 11.98,6.26 11.85,6.39 U16.1
ICE_STM_FLASH_EN  (via drill 0.25)
  Top 0.127: U20.1 18.88,8.29 18.2,7.62 18.2,7.4 R26.1 18.18,7.17 18.75,6.61 v19.04,6.61
  Bottom 0.127: U24.K3 21.32,6.27 20.07,6.27 19.95,6.15 19.4,6.15 19.04,6.51 v19.04,6.61
ICE_STM_SPI_CLK  (via drill 0.25)
  Top 0.127: U18.L10 24.57,13.37 24.57,12.87 24.99,12.46 24.99,10.91 24.29,10.22 v23.97,10.22 23.73,10.22 22.95,9.44 22.95,8.79 23.24,8.51 U19.6
  Bottom 0.127: U24.M6 | U24.M6 23.97,8.27 v23.97,10.21 v23.97,10.22
ICE_STM_SPI_CS_  (via drill 0.25)
  Top 0.127: U18.K10 24.83,13.91 24.83,12.98 26.01,11.8 v26.01,11.61 27.03,10.59 27.03,6.83 26.62,6.41 23.5,6.41 23,6.91 21.3,6.91 20.42,6.03 18.96,6.03 18.11,6.87 17.8,6.87 17.64,7.03 U20.6
  Bottom 0.127: U24.R10 26.73,10.38 26.73,10.89 v26.01,11.61
ICE_STM_SPI_D0  (via drill 0.25)
  Top 0.127: v22.77,12.12 v22.78,12.12 U18.L8
  Bottom 0.127: v22.77,12.12 22.77,11.32 23.28,10.81 23.28,8.47 23.1,8.29 22.93,8.29 22.69,8.05 22.69,8.03 22.62,7.96 22.62,7.81 22.45,7.64 22.16,7.64 21.91,7.38 21.79,7.38 U24.L3
ICE_STM_SPI_D1  (via drill 0.25)
  Top 0.127: U18.L7 22.1,13.44 22.1,10.8 v21.89,10.59
  Bottom 0.127: U24.L2 21.03,7.42 21.39,7.78 21.39,8.05 21.56,8.22 21.74,8.22 21.99,8.47 21.99,10.48 v21.89,10.59
ICE_STM_SPI_D2  (via drill 0.25)
  Top 0.127: v21.11,10.89 20.78,11.22 20.78,13.97 U18.K6
  Bottom 0.127: v21.11,10.89 21.39,10.61 21.39,8.5 21.15,8.26 20.91,8.26 20.73,8.08 20.73,7.8 20.5,7.58 20.27,7.58 20.09,7.41 20.09,6.92 U24.K1
ICE_STM_SPI_D3  (via drill 0.25)
  Top 0.127: v22.77,10.72 22.35,11.14 22.35,13.99 U18.K7
  Bottom 0.127: U24.K2 21.39,6.99 21.39,7.4 21.63,7.64 21.8,7.64 21.97,7.81 21.97,7.98 22.28,8.29 22.46,8.29 22.65,8.49 22.65,10.6 v22.77,10.72
ICE_STM_SPI_D4  (via drill 0.25)
  Top 0.127: U18.K9 24,13.94 v24,13.2 | U19.5 23.82,7.81 23.47,7.46 23.47,7.06 23.75,6.78 26.28,6.78 26.76,7.27 26.76,10.37 26.34,10.79 25.46,10.79 v25,10.33
  Bottom 0.127: U24.R8 25,9.94 v25,10.33 25,10.84 24.3,11.54 24.3,12.9 v24,13.2
ICE_STM_SPI_D5  (via drill 0.25)
  Top 0.127: U19.2 21.34,9.01 22.43,10.09 22.76,10.09 23.2,10.53 v23.2,11.65 v23.19,11.65 23.19,14.78 U18.J9
  Bottom 0.127: U24.P8 24.76,9.4 24.58,9.58 24.58,10.88 23.8,11.65 v23.19,11.65
ICE_STM_SPI_D6  (via drill 0.25)
  Top 0.127: U18.J7 v22.37,15.56
  Bottom 0.127: U24.P9 25.29,9.52 25.29,10.01 25.43,10.15 25.43,10.86 24.77,11.52 24.77,13.38 22.59,15.56 v22.37,15.56
ICE_STM_SPI_D7  (via drill 0.25)
  Top 0.127: v23.18,15.57 v23.18,15.56 U18.J8
  Bottom 0.127: U24.R9 25.7,10 25.7,10.96 25.03,11.63 25.03,13.71 v23.18,15.57
ICE_STM_SPI_D_READY  (via drill 0.25)
  Top 0.127: U18.L5 20.38,10.86 v20.41,10.82
  Bottom 0.127: v20.41,10.82 20.58,10.82 21.13,10.27 21.13,9.98 U24.R2
IMG_CLK16MHZ
  Top 0.127: U21.4 33.12,20.71 33.12,19.64 U22.D7
IMG_D0  (via drill 0.25)
  Top 0.127: v23.18,18.77 U18.E8 | v35.72,18.98 U22.G6
  Bottom 0.127: v35.72,18.98 34.59,20.12 26.12,20.12 25.14,19.14 23.55,19.14 v23.18,18.77
IMG_D1  (via drill 0.25)
  Top 0.127: v25.93,19.25 25.89,19.25 25.4,18.75 24.78,18.75 U18.D10 | v35.72,18.33 | v35.72,18.33 U22.G5
  Bottom 0.127: v25.93,19.25 25.93,19.28 26.5,19.84 34.21,19.84 v35.72,18.33
IMG_D2  (via drill 0.25)
  Top 0.127: U18.G11 25.21,16.8 v25.69,16.8 | U22.H4 v35.73,17.68
  Bottom 0.127: v25.69,16.8 25.72,16.76 30.12,16.76 30.65,16.23 31.21,16.23 31.98,17 32.01,17 arc-90 32.24,16.77 arc90 32.46,16.55 32.5,16.55 arc90 32.72,16.77 arc-90 32.95,17 35.04,17 v35.73,17.68
IMG_D3  (via drill 0.25)
  Top 0.127: v23.98,17.1 23.64,16.76 U18.G9 | U22.G4 v35.07,17.68
  Bottom 0.127: v35.07,17.68 35.02,17.68 34.59,17.25 31.88,17.25 31.1,16.48 30.76,16.48 30.22,17.02 27.21,17.02 26.98,17.25 25.4,17.25 arc90 25.18,17.02 arc-90 24.96,16.8 24.94,16.8 arc-90 24.72,17.02 arc90 24.5,17.25 24.12,17.25 v23.98,17.1
IMG_D4  (via drill 0.25)
  Top 0.127: v23.97,18.71 23.93,18.71 U18.E9 | v35.07,18.34 v35.07,18.33 U22.F5
  Bottom 0.127: v23.97,18.71 24.01,18.75 26.67,18.75 27.58,17.84 31.3,17.84 32.47,19.01 33.45,19.01 34.12,18.34 v35.07,18.34
IMG_D5  (via drill 0.25)
  Top 0.127: v28.59,13.4 28.59,13.41 27.45,14.55 25.37,14.55 U18.K11 | U22.G3 v35.72,16.39 v35.72,16.38
  Bottom 0.127: v28.59,13.4 28.72,13.27 32.68,13.27 34.7,15.28 34.7,15.36 v35.72,16.38
IMG_D6  (via drill 0.25)
  Top 0.127: U18.F9 23.58,17.62 v23.98,18.02 | U22.F4 v34.42,17.68
  Bottom 0.127: v34.42,17.68 33.34,18.75 32.59,18.75 31.43,17.59 27.46,17.59 27.02,18.02 26.7,18.02 arc-90 26.48,18.25 arc90 26.24,18.48 24.67,18.48 arc90 24.44,18.25 arc-90 24.22,18.02 v23.98,18.02
IMG_D7  (via drill 0.25)
  Top 0.127: U18.G8 v23.18,17.17 | v33.12,17.68 v33.13,17.67 33.77,17.67 34.09,17.36 U22.E4
  Bottom 0.127: v23.18,17.17 23.54,17.53 24.78,17.53 arc90 25,17.75 25,18 arc-90 25.23,18.22 25.26,18.22 arc-90 25.48,18 25.48,17.75 arc90 25.7,17.53 27.06,17.53 27.27,17.32 31.53,17.32 31.89,17.68 v33.12,17.68
IMG_D8  (via drill 0.25)
  Top 0.127: v24.78,14.76 U18.J10 | U22.F3 v35.07,16.38
  Bottom 0.127: v24.78,14.76 25.17,14.37 27.97,14.37 28.24,14.64 30.55,14.64 30.85,14.34 33.39,14.34 34.44,15.39 34.44,15.75 v35.07,16.38
IMG_D9  (via drill 0.25)
  Top 0.127: U18.J11 25.63,15.16 v25.72,15.07 | U22.E3 v34.42,16.38
  Bottom 0.127: v34.42,16.38 34.19,16.14 34.19,15.49 33.29,14.6 30.96,14.6 30.48,15.07 29.02,15.07 arc-90 28.82,15.28 28.82,15.8 arc90 28.59,16.03 28.55,16.03 arc90 28.33,15.8 28.33,15.22 arc-90 28.18,15.07 v25.72,15.07
IMG_D10  (via drill 0.25)
  Top 0.127: U18.H11 25.21,15.93 v25.7,15.93 v25.7,15.94 | U22.D3 v33.77,16.38
  Bottom 0.127: v25.7,15.94 26.27,16.51 26.43,16.51 arc-90 26.66,16.29 26.66,15.72 arc90 26.88,15.5 26.91,15.5 arc90 27.13,15.72 27.13,16.29 arc-90 27.35,16.51 27.38,16.51 arc-90 27.6,16.29 27.6,15.72 arc90 27.83,15.5 27.86,15.5 arc90 28.08,15.72 28.08,16.29 arc-90 28.3,16.51 30.01,16.51 30.55,15.97 31.32,15.97 31.64,16.3 33.69,16.3 v33.77,16.38
IMG_D11
  Top 0.127: U18.H10 24.81,15.52 26.31,15.52 arc-90 26.53,15.3 26.53,15.04 arc90 26.75,14.82 26.76,14.82 arc90 26.98,15.04 26.98,15.3 arc-90 27.2,15.52 27.77,15.52 28.96,14.32 33.42,14.32 34.39,15.29 34.39,15.71 34.1,16 U22.E2
IMG_DCLK  (via drill 0.25)
  Top 0.127: U18.F11 25.21,17.53 29.29,17.53 29.7,17.12 29.7,15.95 30,15.66 v30.1,15.66 | U22.E1 v33.77,15.73
  Bottom 0.127: v33.77,15.73 33.59,15.55 arc-90 33.37,15.78 33.37,15.82 arc90 33.14,16.04 32.97,16.04 arc90 32.73,15.8 32.73,15.27 arc-90 32.54,15.08 arc-90 32.33,15.29 32.33,15.82 arc90 32.1,16.04 32.03,16.04 arc90 31.81,15.82 31.81,15.78 arc-90 31.59,15.55 30.21,15.55 v30.1,15.66
IMG_FV
  Top 0.127: U22.B3 32.15,16.73 31.81,17.07 31.38,17.07 30.41,18.04 28.59,18.04 arc-90 28.28,18.34 28.28,19.58 arc90 28.12,19.74 arc90 27.93,19.55 27.93,18.94 arc-45 27.87,18.79 arc-45 27.55,18.66 27.17,18.66 arc-45 26.84,18.8 arc-45 26.71,19.11 26.71,19.27 arc45 26.64,19.43 arc45 26.51,19.49 arc45 26.44,19.46 arc45 26.36,19.27 26.36,18.95 arc-45 26.16,18.47 arc-45 25.91,18.36 U18.E11
IMG_LV
  Top 0.127: U22.C3 32.56,16.71 32.27,16.42 30.45,16.42 30.19,16.68 arc-90 30.19,17.33 arc90 30.19,17.65 30.14,17.69 arc90 29.83,17.69 arc-90 29.52,17.69 29.42,17.78 28.06,17.78 arc-90 27.58,18.26 27.58,18.26 arc90 27.44,18.41 27.42,18.41 arc90 27.25,18.24 27.25,18.03 arc-90 27.01,17.79 arc-90 26.81,17.98 26.81,18.32 arc90 26.62,18.51 arc90 26.44,18.34 26.44,17.9 arc-90 26.33,17.79 26.2,17.79 arc-90 26.07,17.91 26.07,17.95 arc90 25.92,18.11 25.85,18.11 arc90 25.74,18 arc-90 25.6,17.86 25.37,17.86 25.25,17.97 24.77,17.97 U18.E10
IMG_RST_
  Top 0.127: U18.D11 25.76,19.74 26.44,19.74 27.05,20.35 R27.1 29.07,20.6 29.48,21.02 31.74,21.02 U22.C8
IMG_SCLK
  Top 0.127: U18.G10 24.76,16.37 27.92,16.37 29.71,14.59 33.29,14.59 33.55,14.85 33.55,15.3 U22.D1
IMG_SDATA
  Top 0.127: U18.F10 24.72,17.22 26.64,17.22 26.95,16.91 R28.2 27.96,16.85 27.96,16.7 29.45,15.21 30.57,15.21 31.13,15.77 31.85,15.77 U22.B2
MOTION_SIGNAL  (via drill 0.25)
  Top 0.127: U14.19 9.48,0.93 4.24,0.93 3.95,1.22 3.95,11.3 v3.39,11.86
  Bottom 0.127: v3.39,11.86 3.39,17.03 U17.2
MSP_HOST_MODE_  (via drill 0.25)
  Top 0.127: U14.13 v9.02,4.25
  Bottom 0.127: U24.A1 14.83,0.78 14.8,0.75 13.49,0.75 9.98,4.25 v9.02,4.25
MSP_RST_  (via drill 0.25)
  Top 0.127: v17.74,3.04 17.56,2.85 17.56,1.11 17.38,0.93 14.3,0.93 14.06,1.17 14.06,1.63 13.44,2.26 U14.4
  Bottom 0.127: C22.1 17.72,3.06 v17.74,3.04 17.76,3.05 U15.1
MSP_RST_X_
  Bottom 0.127: U24.E2 20.74,3.67 20.21,3.67 19.73,3.19 19.65,3.19 U15.4
MSP_SBW_EN  (via drill 0.25)
  Top 0.127: R17.2 19.47,2.49 v19.47,1.85
  Bottom 0.127: U15.6 19.2,2.45 19.2,2.21 19.47,1.94 v19.47,1.85 19.89,1.43 U24.B1
MSP_TEST  (via drill 0.25)
  Top 0.127: v17.98,2.47 17.98,1.17 17.48,0.67 14.18,0.67 13.81,1.04 13.81,1.52 13.58,1.76 U14.3
  Bottom 0.127: U15.8 18.42,2.47 v17.98,2.47
MSP_TEST_X
  Bottom 0.127: U15.5 19.54,2.5 20.07,3.03 20.73,3.03 U24.D2
N$1
  pour Bottom (no thermals): 39.38,29.88 36.6,29.88 36.6,27.84 37.47,27.84 37.47,28.8 39.9,28.8 39.9,29.26 39.38,29.26
N$2  (via drill 0.25)
  other vias: 26.35,7.44
  pour Bottom (no thermals): 26.03,7.21 26.03,8.02 26.52,8.02 26.52,7.21
  pour Top (no thermals): 25.34,7.62 25.34,7.03 26.52,7.03 26.52,7.62
N$3
  pour Top (rank 2, no thermals): 4.08,24.67 5.3,24.67 5.3,23.7 6.64,23.7 6.64,26.42 5.03,26.42 5.03,27.66 4.57,27.66 4.57,27.48 4.88,27.48 4.88,26.15 4.08,26.15
N$4
  pour Top (no thermals): 36.54,7.51 36.54,7 37.54,7 37.54,7.51
N$7  (via drill 0.25)
  other vias: 27.86,3.71
  pour Bottom (rank 2, no thermals): 28.14,4.17 27.71,3.82 27.67,3.6 27.89,3.42 28.02,3.47 28.31,4.04
  pour Top (no thermals): 27.7,3.91 27.7,2.7 28.83,2.7 28.83,3.46 28.09,3.46 28.09,3.91
N$9
  Top 0.127: U5.4 43.21,16.45 43.21,17.25 R7.1
N$10  (via drill 0.25)
  Top 0.127: R38.2 30.57,5.66 v29.16,5.66
  Bottom 0.127: U24.J15 v29.16,5.66 | v29.16,5.66
N$11
  Bottom 0.127: Q1.3 8.62,29.08 R5.1
N$12
  Bottom 0.127: U3.4 6.49,28.73 R5.2
N$13
  pour Bottom (no thermals): 29.43,29.72 29.43,29.21 29.69,29.21 29.69,26.92 30.19,26.92 30.19,26.16 31.71,26.16 31.71,30.23 30.19,30.23 30.19,29.72
N$14
  Top 0.254: U14.8 13.51,4.26 arc45 15.31,5 X1.2
  Top 0.635: X1.2 C19.1
N$15
  pour Top (no thermals): 27.48,27.44 27.48,26.68 26.13,26.68 26.13,24.9 27.76,24.9 27.76,27.44
N$17
  Top 0.254: U14.7 13.51,3.76 arc-45 15.31,3.01 X1.1
  Top 0.635: C18.1 X1.1
N$18
  Top 0.127: R14.1 26.38,29.04 | 26.38,29.04 26.8,29.04 26.95,29.19 27.32,29.19 27.63,28.88 U8.5 | R13.2 R14.1 26.38,29.04
N$19
  pour Top (no thermals): 24.35,28.06 24.35,23.89 25.55,23.89 25.55,26.94 26.64,26.94 26.64,27.56 25.88,27.56 25.88,28.06
N$20  (via drill 0.25)
  Top 0.127: R18.1 37.8,26.13 v38.38,26.13
  Bottom 0.127: LED1.C 38.26,26.26 v38.38,26.13
N$21
  Bottom 0.127: U4.5 R6.2
N$22
  pour Bottom (no thermals): 28.29,29.72 28.29,28.87 27.99,28.87 27.99,27.1 29.18,27.1 29.18,28.86 28.52,28.86 28.52,29.72
N$23  (via drill 0.25)
  Top 0.127: v38.38,24.73 38.37,24.77 38.69,25.1 R20.1
  Bottom 0.127: v38.38,24.73 38.27,24.82 LED3.C
N$24
  pour Bottom (no thermals): 23.34,25.65 26.03,25.65 26.03,25.35 25.11,25.35 25.11,24.64 23.34,24.64
N$25  (via drill 0.25)
  other vias: 29.16,6.31
  pour Bottom (rank 2, no thermals): 28.79,5.89 28.79,6.02 28.78,6.51 29.36,6.51 29.36,5.89
  pour Top (no thermals): 28.93,6.6 28.93,5.89 30.18,5.89 30.18,6.98 29.57,6.98 29.57,6.6
N$26  (via drill 0.25)
  Top 0.127: R19.1 38.04,25.5 v38.4,25.5
  Bottom 0.127: LED2.C 37.53,25.5 v38.4,25.5
N$27
  Bottom 0.127: LED8.C 41.28,14.5 R37.1
N$28  (via drill 0.25)
  Top 0.127: v38.37,24.04 39.22,24.04 39.94,24.76 R21.1
  Bottom 0.127: LED4.C 37.55,24.04 v38.37,24.04
N$29
  Bottom 0.127: LED7.C 42.24,13.69 R36.1
N$30
  Bottom 0.127: LED6.C 42.12,12.95 R35.1
N$31
  Bottom 0.127: LED5.C 41.99,12.21 R34.1
N$32
  Bottom 0.127: R10.1 39.73,26.94 Q3.6 | Q3.5 39.86,28.36 40.21,28.7 40.21,29.6 39.94,29.86 Q2.3
  pour Bottom (no thermals): 39.91,28.48 38.2,28.48 38.2,27.44 39.91,27.44
N$33
  Bottom 0.127: R15.2 29.26,30.77 29.26,31.29 28.82,31.73 R16.1 28.42,31.43 U9.5
N$34
  Bottom 0.127: U7.5 27.8,25.46 R12.1 28.3,24.96 R11.2
N$35  (via drill 0.25)
  Top 0.127: J11.A5 36.52,4.25 36.17,3.9 v36.17,3.66
  Bottom 0.127: v36.17,3.66 36.81,3.02 R39.1
N$36  (via drill 0.25)
  Top 0.127: J11.B5 35.98,6.65 v35.73,6.41
  Bottom 0.127: R40.1 35.91,6.58 v35.73,6.41
N$38
  Bottom 0.127: C8.1 26.04,23.36 26.75,24.07 27.3,24.07 R11.1
  pour Bottom (rank 2, no thermals): 23.13,23.98 23.13,22 26.64,22 26.64,23.98
N$40
  Top 0.127: U20.4 17.64,10.1 18.27,10.73 19.91,10.73 20.24,10.4 20.59,10.4 20.95,10.05 U19.1
N$42
  Bottom 0.127: U1.4 35.39,29.46 R3.1 R2.2
N$43
  pour Bottom (no thermals): 9.67,29.99 6.53,29.99 6.53,31.29 9.67,31.29
N$54  (via drill 0.38)
  Top 0.127: 36.68,3.11 36.74,3.05 J11.A4 J11.B9 | J11.A9 J11.B4 36.86,7.22 36.8,7.22
  Top 0.381: 36.68,3.11 35.8,3.11 33.98,4.93 33.98,5.69 v35.51,7.22 36.8,7.22
  Bottom 0.381: v35.51,7.22 35.53,7.2 37.81,7.2 38.16,6.85 FB1.1
  pour Bottom (no thermals): 37.35,5.93 37.35,4.4 38.47,4.4 38.47,5.01 37.7,5.01 37.7,5.93
  pour Top (no thermals): 36.54,3.51 36.54,3 37.54,3 37.54,3.51
NIL
  cutout Top (no thermals): 13.79,0.94 17.6,0.94 17.6,7.29 13.79,7.29
RAM_A0  (via drill 0.25)
  Top 0.127: U23.H7 v15.71,25.7 | U18.D5 20.02,19.52 v20.02,19.56
  Bottom 0.127: v20.02,19.56 20.02,20.36 arc90 19.65,20.73 arc-90 19.1,21.28 19.1,23.83 arc90 18.85,24.08 16.82,24.08 arc-90 16.69,24.21 arc-90 16.83,24.34 18.86,24.34 arc90 18.99,24.48 arc90 18.87,24.6 16.54,24.6 arc-90 16.4,24.74 arc-90 16.55,24.89 18.34,24.89 arc90 18.46,25.01 arc90 18.3,25.17 16.25,25.17 arc-90 v15.71,25.7
RAM_A1
  Top 0.127: U18.B3 18.78,20.77 18.43,21.12 18.43,25.09 arc-90 18.59,25.26 arc-90 18.73,25.12 18.73,23.3 arc90 18.86,23.17 arc90 18.98,23.29 18.98,28.66 arc90 18.64,29.01 18.16,29.01 arc90 18.02,28.87 arc90 18.16,28.73 18.56,28.73 arc-90 18.68,28.6 arc-90 18.56,28.48 17.32,28.48 arc90 17.07,28.23 17.07,27.91 arc-38 16.66,26.72 arc33 U23.H8
RAM_A2
  Top 0.127: U18.B2 17.88,20.86 arc-45 17.64,21.46 arc90 17.19,21.91 16.6,21.91 arc-90 16.46,22.05 arc-90 16.58,22.17 17.58,22.17 arc90 17.72,22.31 arc90 17.61,22.42 16.35,22.42 arc-90 16.21,22.57 arc-90 16.32,22.68 17.57,22.68 arc90 17.72,22.83 arc90 17.6,22.95 16.24,22.95 arc-90 16.13,23.07 arc-90 16.26,23.2 arc90 16.77,23.7 16.77,24.64 arc-90 16.89,24.77 arc-90 17.03,24.63 17.03,23.37 arc90 17.19,23.21 arc90 17.31,23.33 17.31,24.67 arc-90 17.46,24.81 arc-90 17.57,24.7 17.57,23.34 arc90 17.7,23.2 arc90 17.79,23.3 17.79,25 arc90 17.64,25.16 U23.J8
RAM_A3
  Top 0.127: U18.A1 16.53,21.56 arc-45 16.32,21.65 15.99,21.98 arc-45 15.95,22.07 15.95,22.6 arc45 15.91,22.69 15.82,22.78 13.94,22.78 arc-90 13.81,22.91 13.81,22.95 arc-90 13.94,23.08 15.72,23.08 arc90 15.84,23.2 15.84,23.33 arc90 15.74,23.42 13.41,23.42 arc-90 13.27,23.57 13.27,23.65 arc-90 13.37,23.75 15.17,23.75 arc90 15.29,23.88 15.29,23.99 arc90 15.16,24.11 12.82,24.11 arc-90 12.74,24.2 12.74,24.93 arc-90 12.87,25.05 14.07,25.05 14.76,24.36 15.35,24.36 15.57,24.59 U23.J7
RAM_A4
  Top 0.127: U23.J3 14.01,22.31 13.81,22.11 13.81,20.91 arc90 13.94,20.78 14.14,20.78 arc90 14.34,20.98 14.34,22.39 arc-90 14.48,22.53 14.51,22.53 arc-90 14.64,22.4 14.64,20.69 arc90 14.76,20.58 arc90 14.93,20.75 14.93,22.37 arc-90 15.06,22.51 arc-90 15.18,22.4 15.18,19.53 arc90 15.3,19.41 arc90 15.44,19.55 15.44,21.88 arc-90 15.58,22.02 arc-90 15.73,21.87 15.73,20.09 arc90 15.89,19.93 15.93,19.93 arc90 16.08,20.08 16.08,20.99 arc-90 16.27,21.18 arc-90 16.4,21.05 16.4,20.88 arc90 16.51,20.76 U18.B1
RAM_A5
  Top 0.127: U23.J2 13.44,20.96 arc-90 13.37,20.89 13.17,20.89 arc90 12.99,20.71 12.99,20.7 arc90 13.12,20.57 13.49,20.57 arc-90 13.81,20.24 13.81,17.91 arc90 13.89,17.84 13.97,17.84 arc90 14.04,17.91 14.04,20.39 arc-90 14.17,20.52 14.2,20.52 arc-90 14.29,20.42 14.29,17.96 arc90 14.42,17.84 arc90 14.57,17.99 14.57,20.18 arc-90 14.71,20.32 14.73,20.32 arc-90 14.86,20.18 14.86,18.68 arc90 14.95,18.6 15.03,18.6 16.75,20.31 17.63,20.31 U18.C2
RAM_A6  (via drill 0.25)
  Top 0.127: U23.H3 v12.88,22.9 v12.87,22.9 | U18.C4 19.27,20.27 v19.27,20.36
  Bottom 0.127: v19.27,20.36 18.85,20.78 arc45 17.78,21.23 13.89,21.23 arc90 13.74,21.07 arc90 13.88,20.94 17.82,20.94 arc-90 17.95,20.81 arc-90 17.79,20.65 13.51,20.65 arc-45 12.58,21.03 arc-45 12.29,21.75 arc-45 12.69,22.72 v12.87,22.9
RAM_A7
  Top 0.127: U23.H2 12.73,22.18 12.22,22.18 11.71,21.66 11.71,21.2 12.86,20.05 12.86,16.8 arc90 13.47,16.19 arc90 14.07,16.78 14.07,17.19 arc-90 14.18,17.31 arc-90 14.35,17.14 14.35,16.41 arc90 14.46,16.3 arc90 14.63,16.47 14.63,17.19 arc-90 14.76,17.32 arc-90 14.96,17.12 14.96,16.05 arc90 15.16,15.85 arc90 15.32,16.01 15.32,18.14 16.68,19.5 17.66,19.5 17.98,19.18 U18.D2
RAM_A8
  Top 0.127: U23.H1 12.03,21.48 12.03,21.23 13.12,20.14 13.12,16.72 arc173 13.33,16.73 13.33,20.21 arc-90 13.42,20.3 arc-90 13.55,20.18 13.55,16.7 arc90 13.67,16.57 arc90 13.79,16.7 13.79,17.41 13.96,17.58 14.96,17.58 15.06,17.68 15.06,18.25 16.57,19.76 16.97,19.76 U18.C1
RAM_A9  (via drill 0.25)
  Top 0.127: U23.G3 v12.32,23.46 | U18.C3 v18.38,20.44
  Bottom 0.127: v18.38,20.44 arc-90 18.16,20.22 13.81,20.22 arc90 13.68,20.09 arc90 13.81,19.97 17.35,19.97 arc-90 17.5,19.82 arc-90 17.37,19.68 13.29,19.68 arc-45 12.35,20.07 arc-45 11.78,21.45 11.78,22.17 arc-45 v12.32,23.46
RAM_A10
  Top 0.127: U18.A2 arc90 18.13,21.71 18.13,25.3 arc-90 18.38,25.56 arc90 18.64,25.81 18.64,28.07 arc90 18.51,28.2 arc90 18.39,28.08 18.39,25.93 arc-90 18.25,25.8 arc-90 18.12,25.92 18.12,28.07 arc90 17.99,28.2 arc90 17.88,28.08 17.88,26.27 arc-90 17.75,26.15 arc-90 17.64,26.26 17.64,28.09 arc90 17.52,28.21 arc90 17.37,28.05 17.37,26.54 arc-90 17.12,26.29 U23.H9
RAM_A11
  Top 0.127: U23.G2 11.76,22.9 11.38,22.52 11.38,21.16 12.6,19.94 12.6,15.2 arc90 12.79,15.02 12.88,15.02 arc90 13.09,15.22 13.09,15.73 arc-90 13.29,15.93 13.41,15.93 arc-90 13.61,15.73 13.61,15.3 arc90 13.83,15.09 13.91,15.09 arc90 14.1,15.28 14.1,15.61 arc-90 14.31,15.81 14.39,15.81 arc-90 14.63,15.57 14.63,15.33 arc90 14.87,15.09 14.96,15.09 15.58,15.7 15.58,18 arc-90 15.59,18.01 16.54,18.96 16.97,18.96 U18.D1
RAM_BA0  (via drill 0.25)
  Top 0.127: U23.G7 v15.14,26.27 v15.14,26.28 | U18.C7 22.32,20.3 v22.32,20.36
  Bottom 0.127: v22.32,20.36 arc90 22.61,20.65 22.61,24.8 arc45 22.5,25.07 arc45 22.13,25.23 20.16,25.23 arc90 19.98,25.04 arc90 20.12,24.9 22.18,24.9 arc-180 22.18,24.6 19.49,24.6 arc-45 19.21,24.72 18.14,25.79 arc-45 18.13,25.81 arc45 16.99,26.28 v15.14,26.28
RAM_BA1
  Top 0.127: U18.B4 arc-90 19.14,21.2 19.14,22.53 arc-90 19.3,22.68 arc90 19.55,22.93 19.55,30.18 arc90 19.03,30.7 18.52,30.7 arc90 18.39,30.57 arc90 18.51,30.45 19.05,30.45 arc-90 19.2,30.3 arc-90 19.06,30.17 16.95,30.17 arc90 16.53,29.75 16.53,28.33 arc-45 16.04,27.15 arc45 15.71,26.34 U23.G8
RAM_CAS_  (via drill 0.25)
  Top 0.127: U23.F7 v14.58,26.83 v14.58,26.84 | U18.D7 v22.37,19.55 v22.37,19.56
  Bottom 0.127: v22.37,19.56 arc90 22.87,20.06 22.87,25.05 arc90 22.39,25.53 20.99,25.53 arc-90 20.8,25.71 arc-90 20.99,25.9 22.06,25.9 arc90 22.26,26.11 arc90 22.06,26.31 18.51,26.31 arc-45 17.88,26.57 arc45 17.24,26.84 v14.58,26.84
RAM_CKE  (via drill 0.25)
  Top 0.127: U23.F3 11.77,24.03 v11.74,24 | U18.D3 v18.38,19.48
  Bottom 0.127: v11.74,24 arc45 11.27,22.86 11.27,20.69 arc45 11.78,19.46 arc45 13.12,18.9 16.62,18.9 arc90 16.75,19.03 arc90 16.62,19.16 13.83,19.16 arc-90 13.7,19.29 arc-90 13.83,19.43 18.26,19.43 arc45 v18.38,19.48
RAM_CLK
  Top 0.127: U23.F2 11.56,23.27 11.03,23.27 10.82,23.07 10.82,21.01 12.1,19.73 12.1,14.57 12.7,13.96 15.17,13.96 15.54,14.33 15.54,14.93 16.1,15.48 16.1,17.8 16.66,18.36 U18.E1
RAM_CS_
  Top 0.127: U18.A3 18.78,22.78 arc-90 18.91,22.91 19.12,22.91 arc90 19.29,23.08 19.29,29.5 arc90 18.93,29.86 17.03,29.86 arc90 16.89,29.73 arc90 17.02,29.6 18.75,29.6 arc-90 18.9,29.45 arc-90 18.73,29.27 17.03,29.27 arc90 16.89,29.13 arc90 17.02,29 17.54,29 arc-90 17.68,28.86 arc-90 17.56,28.74 17.32,28.74 arc90 16.79,28.21 16.79,27.73 arc-45 16.54,27.13 U23.G9
RAM_DQ0  (via drill 0.25)
  Top 0.127: U23.A8 12.27,29.73 v12.27,30.24 | U18.A9 23.58,22.77 arc-45 23.68,23.01 arc45 23.76,23.2 23.76,25.94 arc-45 v23.9,26.28
  Bottom 0.127: v12.27,30.24 arc-45 13.22,30.64 20.29,30.64 arc-45 22.08,29.89 23.83,28.14 arc-45 24.04,27.66 24.04,27.42 arc-45 23.94,27.2 arc45 23.9,27.09 v23.9,26.28
RAM_DQ1  (via drill 0.25)
  Top 0.127: U23.B9 arc-90 13.56,29.8 v14.12,29.8 | U18.A8 22.78,22.56 arc-45 22.93,22.93 arc45 23.18,23.52 23.18,26.75 arc-45 v23.21,26.83
  Bottom 0.127: v23.21,26.83 arc45 22.49,28.56 22.19,28.86 arc45 21.39,29.19 18.62,29.19 arc-90 18.47,29.34 arc-90 18.6,29.48 19.32,29.48 arc90 19.49,29.65 arc90 19.31,29.83 14.14,29.83 arc90 v14.12,29.8
RAM_DQ2  (via drill 0.25)
  Top 0.127: U23.B8 v12.88,29.7 | U18.B9 arc-45 23.21,21.66 23.21,22.76 arc-45 23.3,22.99 arc45 23.48,23.4 23.48,26.33 arc-45 23.57,26.54 arc45 23.65,26.74 23.65,27.41 arc45 v23.61,27.49
  Bottom 0.127: v23.61,27.49 arc45 23.3,28.26 22.06,29.5 arc45 20.26,30.25 14.19,30.25 arc45 v12.88,29.7
RAM_DQ3
  Top 0.127: U18.A7 21.98,22.5 arc-45 22.19,23.02 arc45 22.33,23.35 22.33,27.33 arc45 20.57,31.57 20.53,31.62 arc45 19.22,32.16 15.98,32.16 arc45 15.04,31.77 arc45 14.57,30.65 14.57,29.62 arc-90 14.07,29.12 U23.C9
RAM_DQ4  (via drill 0.25)
  Top 0.127: U23.C8 13.44,29.13 arc-90 v13.46,29.14 | U18.B8 22.77,20.78 arc-45 22.39,21.68 22.39,22.51 arc-45 22.55,22.88 arc45 22.75,23.37 v22.75,26.32
  Bottom 0.127: v13.46,29.14 arc-45 13.98,29.36 16.3,29.36 arc-90 16.44,29.22 arc-90 16.33,29.11 15.87,29.11 arc90 15.76,29.01 arc90 15.89,28.88 21.28,28.88 arc-45 21.94,28.6 22,28.54 arc-45 22.75,26.74 v22.75,26.32
RAM_DQ5
  Top 0.127: U23.D9 arc90 14.83,28.8 14.83,30.64 arc-90 16.1,31.91 19.21,31.91 arc-45 20.21,31.49 20.58,31.12 arc-45 21.48,28.94 21.48,23.68 arc-45 21.4,23.47 21.15,23.22 arc45 21.09,23.08 21.09,21.65 U18.A6
RAM_DQ6  (via drill 0.25)
  Top 0.127: U23.D8 v14,28.54 | U18.B7 U18.B7 arc-45 21.6,21.66 21.6,23.07 arc-45 21.68,23.27 arc45 21.91,23.8 v21.91,27.52
  Bottom 0.127: v21.91,27.52 21.91,27.65 arc90 21.66,27.89 20.12,27.89 arc-90 19.94,28.08 arc-90 20.08,28.22 21.27,28.22 arc90 21.45,28.41 arc90 21.28,28.57 14.03,28.57 arc90 v14,28.54
RAM_DQ7
  Top 0.127: U18.A5 20.38,30.42 arc90 19.14,31.65 16.33,31.65 arc90 15.23,30.55 15.23,30.15 arc90 15.33,30.05 arc90 15.45,30.16 15.45,30.3 arc-90 15.57,30.43 arc-90 15.68,30.32 15.68,29.28 arc-45 U23.E9
RAM_DQ8  (via drill 0.25)
  Top 0.127: U23.E1 v10.62,24 v10.62,24.01 | v17.62,17.94 17.98,17.58 U18.F2
  Bottom 0.127: v17.62,17.94 17.05,18.5 arc45 16.72,18.64 13.74,18.64 arc90 13.64,18.54 arc90 13.74,18.43 16.39,18.43 arc-90 16.49,18.34 16.49,18.29 arc-90 16.39,18.2 13.16,18.2 arc-90 10.62,20.74 v10.62,24.01
RAM_DQ9  (via drill 0.25)
  Top 0.127: U18.G2 17.98,16.81 v17.6,17.19 | U23.D2 10.6,24.57 v10.06,24.57